# EAGLE design socket-v2-low-voltage (EAGLE 6.2)
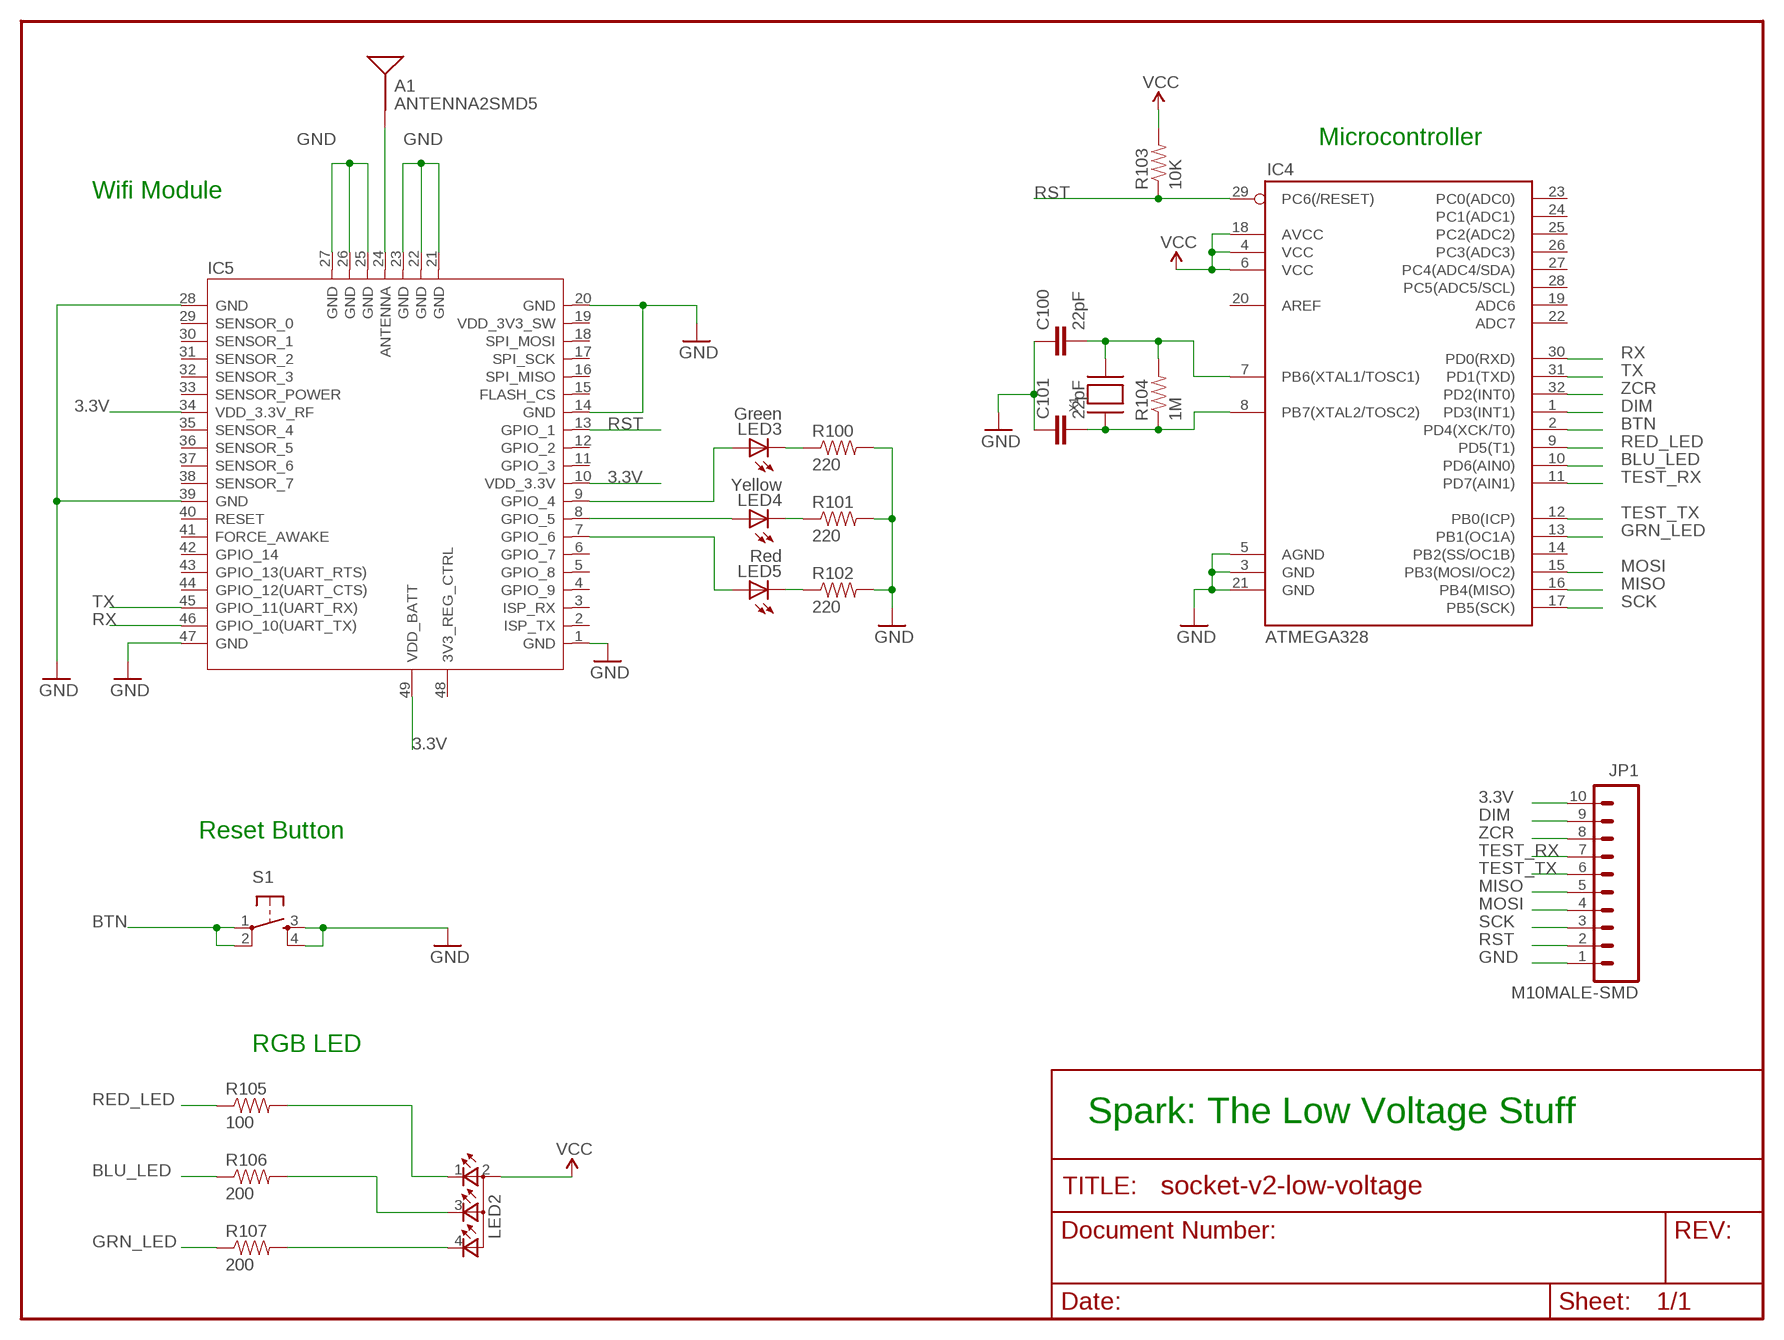
[diagram p0: schematic, sheet 1]

## Parts
A1  ANTENNA2SMD5  [ANTENNA-CHIP5]
C100  22pF  CAP0603-CAP  [0603-CAP]
C101  22pF  CAP0603-CAP  [0603-CAP]
IC4  ATMEGA328  ATMEGA168  [TQFP32-08]
IC5  WIFI-RN-171  [49P-1.27-26.67X17.78]
JP1  M10MALE-SMD  [1X10-2MM-MALE-SMD]
LED2  TOPLED-3PLCC  [P-LCC-4-3]
LED3  Green  LED0603  [LED-0603]
LED4  Yellow  LED0603  [LED-0603]
LED5  Red  LED0603  [LED-0603]
R100  220  RESISTOR0603-RES  [0603-RES]
R101  220  RESISTOR0603-RES  [0603-RES]
R102  220  RESISTOR0603-RES  [0603-RES]
R103  10K  RESISTOR0603-RES  [0603-RES]
R104  1M  RESISTOR0603-RES  [0603-RES]
R105  100  RESISTOR0603-RES  [0603-RES]
R106  200  RESISTOR0603-RES  [0603-RES]
R107  200  RESISTOR0603-RES  [0603-RES]
S1  TAC_SWITCHSMD  [TACTILE_SWITCH_SMD]
X1  XTALNX5032  [NX5032]

## Nets
3.3V: IC4.4(VCC) IC4.6(VCC) IC4.18(AVCC) IC5.10(VDD_3.3V) IC5.34(VDD_3.3V_RF) IC5.49(VDD_BATT) JP1.10 LED2.2(A2) R103.2 ; supply symbol labelled VCC
BLU_LED: IC4.10(PD6(AIN0)) R106.1
BTN: IC4.2(PD4(XCK/T0)) S1.1 S1.2
DIM: IC4.1(PD3(INT1)) JP1.9
GND: C100.1 C101.1 IC4.3(GND) IC4.5(AGND) IC4.21(GND) IC5.1(GND) IC5.14(GND) IC5.20(GND) IC5.21(GND) IC5.22(GND) IC5.23(GND) IC5.25(GND) IC5.26(GND) IC5.27(GND) IC5.28(GND) IC5.39(GND) IC5.47(GND) JP1.1 R100.2 R101.2 R102.2 S1.3 S1.4
GRN_LED: IC4.13(PB1(OC1A)) R107.1
MISO: IC4.16(PB4(MISO)) JP1.5
MOSI: IC4.15(PB3(MOSI/OC2)) JP1.4
N$1: LED2.1(CRED) R105.2
N$8: LED2.4(CGREEN) R107.2
N$15: LED2.3(CBLUE) R106.2
N$19: IC5.9(GPIO_4) LED3.A
N$20: LED3.C R100.1
N$21: LED4.C R101.1
N$22: LED5.C R102.1
N$23: IC5.8(GPIO_5) LED4.A
N$24: IC5.7(GPIO_6) LED5.A
N$25: A1.FEED(SIGNAL) IC5.24(ANTENNA)
N$38: C100.2 IC4.7(PB6(XTAL1/TOSC1)) R104.2 X1.P$2
RED_LED: IC4.9(PD5(T1)) R105.1
RST: IC4.29(PC6(/RESET)) IC5.13(GPIO_1) JP1.2 R103.1
RX: IC4.30(PD0(RXD)) IC5.46(GPIO_10(UART_TX))
SCK: IC4.17(PB5(SCK)) JP1.3
TEST_RX: IC4.11(PD7(AIN1)) JP1.7
TEST_TX: IC4.12(PB0(ICP)) JP1.6
TX: IC4.31(PD1(TXD)) IC5.45(GPIO_11(UART_RX))
XTAL1: C101.2 IC4.8(PB7(XTAL2/TOSC2)) R104.1 X1.P$1
ZCR: IC4.32(PD2(INT0)) JP1.8
Unconnected: IC4.14(PB2(SS/OC1B)) IC4.19(ADC6) IC4.20(AREF) IC4.22(ADC7) IC4.23(PC0(ADC0)) IC4.24(PC1(ADC1)) IC4.25(PC2(ADC2)) IC4.26(PC3(ADC3)) IC4.27(PC4(ADC4/SDA)) IC4.28(PC5(ADC5/SCL)) IC5.2(ISP_TX) IC5.3(ISP_RX) IC5.4(GPIO_9) IC5.5(GPIO_8) IC5.6(GPIO_7) IC5.11(GPIO_3) IC5.12(GPIO_2) IC5.15(FLASH_CS) IC5.16(SPI_MISO) IC5.17(SPI_SCK) IC5.18(SPI_MOSI) IC5.19(VDD_3V3_SW) IC5.29(SENSOR_0) IC5.30(SENSOR_1) IC5.31(SENSOR_2) IC5.32(SENSOR_3) IC5.33(SENSOR_POWER) IC5.35(SENSOR_4) IC5.36(SENSOR_5) IC5.37(SENSOR_6) IC5.38(SENSOR_7) IC5.40(RESET) IC5.41(FORCE_AWAKE) IC5.42(GPIO_14) IC5.43(GPIO_13(UART_RTS)) IC5.44(GPIO_12(UART_CTS)) IC5.48(3V3_REG_CTRL)

## Notes on the sheet
- Microcontroller
- Wifi Module
- Reset Button
- RGB LED
- Spark: The Low Voltage Stuff

## Library data of the parts
A1 = SparkFun:ANTENNA2: Antenna Single endded antenna. Common with smaller chip antennas. CHIP4 package is the GPS Chip Antenna SKU: GPS-08418. CHIP5 package is 2.4GHz chip antenna SKU: WRL-00144.
C100 C101 = SparkFun:CAP: Capacitor Standard 0603 ceramic capacitor, and 0.1" leaded capacitor.
IC4 = SparkFun:ATMEGA168
IC5 = Module:WIFI-RN-171: WIFLY GSX 802.11 b/g wireless LAN Module
JP1 = Spark-3:M10: Header 10 Standard 10-pin 0.1" header. Use with straight break away headers (SKU : PRT-00116), right angle break away headers (PRT-00553), swiss pins (PRT-00743), machine pins (PRT-00117), and female headers (PRT-00115).
LED2 = Spark:TOPLED-3: Cree CLVBA-FKA
LED3-LED5 = SparkFun:LED: LEDs Standard schematic elements and footprints for 5mm, 3mm, 1206, and 0603 sized LEDs. 5mm - Spark Fun Electronics SKU : COM-00529 (and others)
R100-R107 = SparkFun:RESISTOR: Resistor Basic schematic elements and footprints for 0603, 1206, and PTH resistors.
S1 = SparkFun:TAC_SWITCH: Momentary Switch Button commonly used for reset or general input. Spark Fun Electronics SKU : COM-00097
X1 = adafruit:XTAL: Low cost SMT crystals, no capacitors included http://www.ladyada.net/library/eagle

## Net classes
2 gnd: width 0.203 mm, drill 0.559 mm, clearance 0.152 mm
3 usbvcc: width 0.203 mm, drill 0.61 mm, clearance 0.152 mm
4 aref: width 0.203 mm, drill 0.61 mm, clearance 0.152 mm

## Board
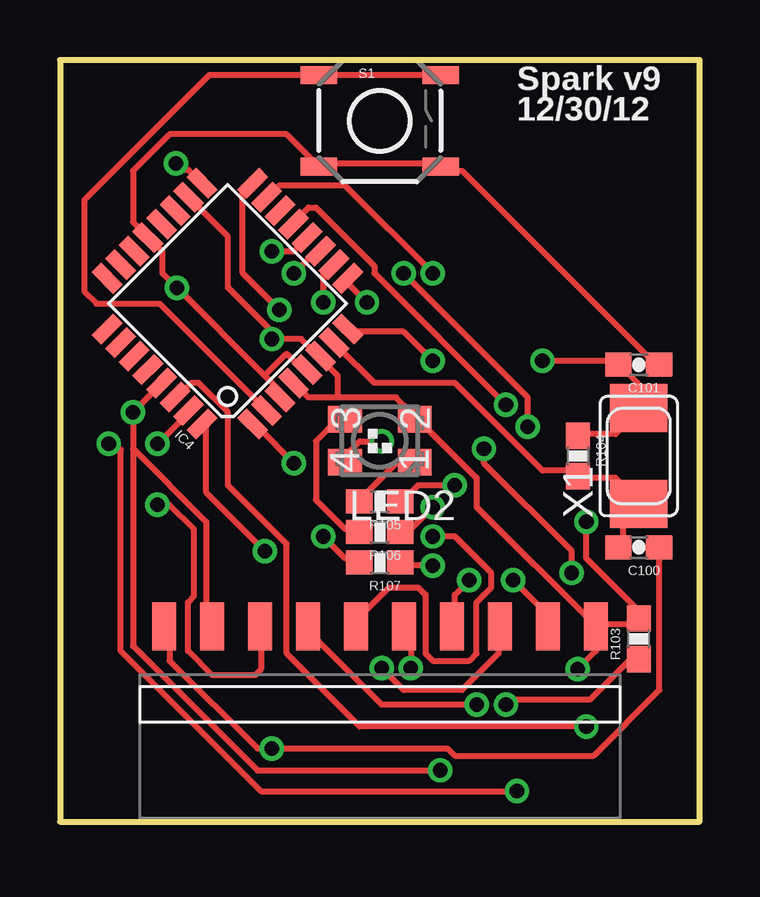
[diagram p1: board, top side]
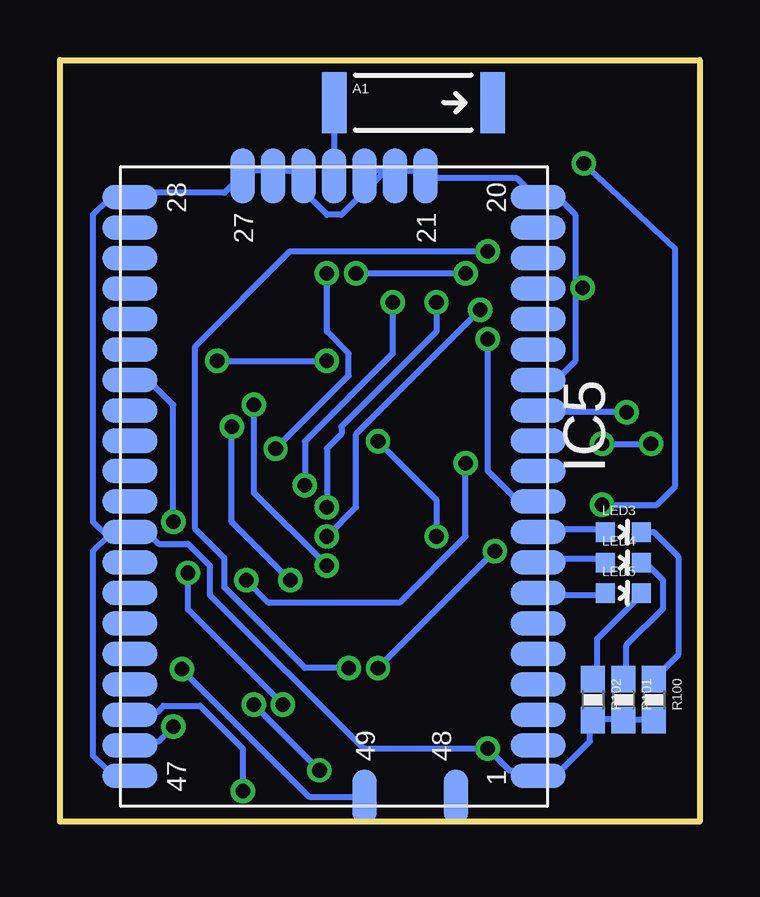
[diagram p2: board, bottom side, seen from below]

Size 26.67 x 31.75 mm. Coordinates in mm from the lower left corner, seen from the top.
Outline: 0,0 26.67,0 26.67,31.75 0,31.75 0,0
Copper layers (1*16): Top 0.035mm / dielectric 1.5mm / Bottom 0.035mm
Design rules: minimum track width 10mil, minimum drill 24mil, track to track 8mil, track to pad 8mil, pad to pad 8mil, via to via 8mil, smd to smd 8mil, copper to edge 40mil, drill to drill 8mil, minimum pad ring 12mil, minimum via ring 8mil, stop-mask expansion 4mil, vias tented up to drill 0mil, thermal gap 10mil

### Footprints (pad centres in the part's own frame; a part is rotated, then mirrored left to right if it is on the bottom)
ANTENNA-CHIP5 = smd 1.016 x 2.54: FEED -3.302,0; NC 3.302,0
0603-CAP = smd 1.1 x 1: 1 -0.85,0; 2 0.85,0
TQFP32-08 = smd 1.27 x 0.559: 1 -4.293,2.8; 2 -4.293,2; 3 -4.293,1.2; 4 -4.293,0.4; 5 -4.293,-0.4; 6 -4.293,-1.2; 7 -4.293,-2; 8 -4.293,-2.8; 17 4.293,-2.8; 18 4.293,-2; 19 4.293,-1.2; 20 4.293,-0.4; 21 4.293,0.4; 22 4.293,1.2; 23 4.293,2; 24 4.293,2.8 | smd 0.559 x 1.27: 9 -2.8,-4.293; 10 -2,-4.293; 11 -1.2,-4.293; 12 -0.4,-4.293; 13 0.4,-4.293; 14 1.2,-4.293; 15 2,-4.293; 16 2.8,-4.293; 25 2.8,4.293; 26 2,4.293; 27 1.2,4.293; 28 0.4,4.293; 29 -0.4,4.293; 30 -1.2,4.293; 31 -2,4.293; 32 -2.8,4.293
49P-1.27-26.67X17.78 = smd 1.016 x 2.286: 1 12.065,8.509; 2 10.795,8.509; 3 9.525,8.509; 4 8.255,8.509; 5 6.985,8.509; 6 5.715,8.509; 7 4.445,8.509; 8 3.175,8.509; 9 1.905,8.509; 10 0.635,8.509; 11 -0.635,8.509; 12 -1.905,8.509; 13 -3.175,8.509; 14 -4.445,8.509; 15 -5.715,8.509; 16 -6.985,8.509; 17 -8.255,8.509; 18 -9.525,8.509; 19 -10.795,8.509; 20 -12.065,8.509; 28 -12.065,-8.509; 29 -10.795,-8.509; 30 -9.525,-8.509; 31 -8.255,-8.509; 32 -6.985,-8.509; 33 -5.715,-8.509; 34 -4.445,-8.509; 35 -3.175,-8.509; 36 -1.905,-8.509; 37 -0.635,-8.509; 38 0.635,-8.509; 39 1.905,-8.509; 40 3.175,-8.509; 41 4.445,-8.509; 42 5.715,-8.509; 43 6.985,-8.509; 44 8.255,-8.509; 45 9.525,-8.509; 46 10.795,-8.509; 47 12.065,-8.509 | smd 2.286 x 1.016: 21 -12.954,3.81; 22 -12.954,2.54; 23 -12.954,1.27; 24 -12.954,0; 25 -12.954,-1.27; 26 -12.954,-2.54; 27 -12.954,-3.81; 48 12.954,5.08; 49 12.954,1.27
1X10-2MM-MALE-SMD = smd 1 x 2: 1 -9,0; 2 -7,0; 3 -5,0; 4 -3,0; 5 -1,0; 6 1,0; 7 3,0; 8 5,0; 9 7,0; 10 9,0
P-LCC-4-3 = smd 1.1 x 1.4: 1 -0.9,-1.45; 2 0.9,-1.45; 3 0.9,1.45; 4 -0.9,1.45
LED-0603 = smd 0.8 x 0.8: A 0,-0.75; C 0,0.75
0603-RES = smd 1.1 x 1: 1 -0.85,0; 2 0.85,0
TACTILE_SWITCH_SMD = smd 1.524 x 0.762: 1 -2.54,1.905; 2 2.54,1.905; 3 -2.54,-1.905; 4 2.54,-1.905
NX5032 = smd 2 x 2.4: P$1 2,0; P$2 -2,0

### Placement (x,y rotation side)
A1  11.94,29.97 0 bottom
C100  24.13,11.43 180 top
C101  24.13,19.05 180 top
IC4  6.99,21.59 135 top
IC5  15.24,13.97 270 bottom
JP1  13.34,8.13 0 top
LED2  13.34,15.88 90 top
LED3  3.17,12.06 270 bottom
LED4  3.17,10.79 270 bottom
LED5  3.17,9.53 270 bottom
R100  1.91,5.08 270 bottom
R101  3.17,5.08 270 bottom
R102  4.45,5.08 270 bottom
R103  24.13,7.62 90 top
R104  21.59,15.24 270 top
R105  13.34,13.34 180 top
R106  13.34,12.06 180 top
R107  13.34,10.79 180 top
S1  13.34,29.21 0 top
X1  24.13,15.24 90 top

### Tracks (layer width: path | path; a pad name or v marks a point on that pad's centre or on a via)
3.3V  (via drill 0.61)
  Top 0.254: JP1.10 22.55,8.23 24.08,8.23 R103.2 24.38,8.53 21.95,10.97 v21.95,12.5 | 11.58,17.68 14.02,17.68 14.63,17.07 LED2.2 14.94,16.76 17.37,14.33 17.37,13.11 22.25,8.23 JP1.10 | 11.58,17.68 10.36,17.68 9.75,18.29 IC4.4 | 8.84,20.42 9.14,20.12 10.06,20.12 10.67,19.51 IC4.6 10.97,19.2 11.58,18.59 11.58,17.68 | 8.84,20.42 7.01,22.25 7.01,24.38 5.49,25.91 IC4.18 | 8.84,20.42 v8.84,20.12 | v21.59,6.35 22.35,7.11 22.35,8.13 JP1.10
  Bottom 0.254: v21.95,12.5 21.95,17.37 22.86,18.29 23.47,18.29 IC5.34 | v8.84,20.12 8.84,14.63 7.62,13.41 7.01,13.41 IC5.10 | IC5.49 16.26,1.02 v21.59,6.35
BLU_LED  (via drill 0.61)
  Top 0.254: v15.54,13.11 14.63,12.19 14.33,12.19 R106.1 | v10.97,21.64 10.97,22.86 11.28,23.16 IC4.10
  Bottom 0.254: v15.54,13.11 15.54,15.54 14.94,16.15 14.94,16.46 10.97,20.42 v10.97,21.64
BTN
  Top 0.254: S1.2 S1.1 6.22,31.11 1.02,25.91 1.02,22.1 1.52,21.59 4.16,21.59 IC4.2
DIM  (via drill 0.61)
  Top 0.254: v9.75,14.94 8.23,16.46 IC4.1 | v18.9,10.06 20.12,8.84 20.12,8.23 JP1.9
  Bottom 0.254: v9.75,14.94 9.75,11.89 12.5,9.14 17.98,9.14 v18.9,10.06
GND  (via drill 0.61)
  Top 0.254: C100.1 24.99,11.28 24.99,5.49 22.25,2.74 16.46,2.74 16.15,3.05 v8.84,3.05 8.23,3.05 4.57,6.71 4.57,7.92 JP1.1 | 8.53,18.59 v4.88,22.25 4.27,22.86 4.27,23.77 3.96,24.08 IC4.21 3.66,24.38 3.05,24.99 3.05,27.13 4.57,28.65 9.45,28.65 S1.3 10.97,27.43 15.85,27.43 S1.4 16.15,27.13 16.76,27.13 24.69,19.2 C101.1 | 8.53,18.59 9.14,17.98 IC4.3 | 8.53,18.59 9.45,19.51 10.06,18.9 IC4.5
  Bottom 0.254: R100.2 2.13,4.27 3.05,4.27 R101.2 3.35,4.27 4.27,4.27 R102.2 4.57,3.96 4.57,3.35 5.79,2.13 6.71,2.13 IC5.1 7.01,2.13 7.92,2.13 v8.84,3.05 14.02,3.05 20.42,9.45 20.42,10.67 21.34,11.58 22.55,11.58 22.86,11.89 23.47,11.89 IC5.39 | 24.69,11.89 25.3,11.28 25.3,2.74 24.69,2.13 23.77,2.13 IC5.47 | 24.69,11.89 23.77,11.89 IC5.39 | IC5.22 12.5,27.13 11.58,27.13 IC5.21 11.28,26.82 7.62,26.82 7.01,26.21 IC5.20 6.71,25.91 5.79,25.91 5.18,25.3 5.18,22.25 | 13.11,27.13 12.8,27.13 IC5.22 | 13.11,27.13 13.72,27.13 IC5.23 | 5.18,22.25 5.18,19.2 5.79,18.59 6.71,18.59 IC5.14 | 13.11,27.13 14.94,25.3 15.54,25.3 16.46,26.21 16.46,26.82 IC5.25 16.76,27.13 17.68,27.13 IC5.26 17.98,27.13 18.9,27.13 IC5.27 19.2,26.82 19.81,26.21 23.47,26.21 IC5.28 23.77,25.91 24.69,25.91 25.3,25.3 25.3,12.5 24.69,11.89 | 13.11,27.13 IC5.22 | 24.69,11.89 IC5.39 | 5.18,22.25 v4.88,22.25
GRN_LED  (via drill 0.61)
  Top 0.254: v15.54,10.67 14.33,10.67 R107.1 | v18.59,17.37 13.11,22.86 13.11,23.16 10.67,25.6 10.36,25.6 9.75,24.99 IC4.13
  Bottom 0.254: v15.54,10.67 18.59,13.72 v18.59,17.37
MISO  (via drill 0.61)
  Top 0.254: v9.14,21.34 7.62,22.86 7.62,26.21 7.92,26.52 IC4.16 | v15.54,11.89 16.46,11.89 17.98,10.36 17.98,9.75 17.37,9.14 17.37,7.01 17.07,6.71 15.54,6.71 15.24,7.01 15.24,9.45 14.94,9.75 13.72,9.75 12.19,8.23 JP1.5
  Bottom 0.254: v9.14,21.34 14.33,16.15 14.33,13.11 v15.54,11.89
MOSI  (via drill 0.61)
  Top 0.254: v15.54,22.86 11.89,26.52 9.14,26.52 8.84,26.21 IC4.15 | v17.68,15.54 17.68,14.94 21.34,11.28 v21.34,10.36 | v17.37,4.88 13.41,4.88 10.36,7.92 JP1.4
  Bottom 0.254: v15.54,22.86 15.54,20.42 14.63,19.51 14.63,18.59 v17.68,15.54 | v21.34,10.36 21.34,8.84 v17.37,4.88
N$1
  Top 0.254: R105.2 12.5,13.41 14.02,14.94 14.63,14.94 LED2.1
N$8  (via drill 0.61)
  Top 0.254: v10.97,11.89 11.89,10.97 12.19,10.97 R107.2 | v13.41,15.85 12.5,15.85 11.89,15.24 LED2.4
  Bottom 0.254: v10.97,11.89 10.97,13.41 v13.41,15.85
N$15
  Top 0.254: R106.2 12.19,12.19 11.89,12.19 10.67,13.41 10.67,15.85 11.58,16.76 LED2.3
N$19
  Bottom 0.254: LED3.A 3.96,12.19 6.71,12.19 IC5.9
N$20
  Bottom 0.254: LED3.C 1.91,12.06 0.89,11.05 0.89,6.95 R100.1
N$21
  Bottom 0.254: LED4.C 2.13,10.67 1.52,10.06 1.52,8.89 3.05,7.37 3.05,6.1 R101.1
N$22
  Bottom 0.254: LED5.C 2.44,9.45 4.27,7.62 4.27,6.1 R102.1
N$23
  Bottom 0.254: LED4.A 3.96,10.97 6.71,10.97 IC5.8
N$24
  Bottom 0.254: LED5.A 3.96,9.45 6.71,9.45 IC5.7
N$25
  Bottom 0.254: A1.FEED IC5.24
N$38
  Top 0.254: 23.47,14.02 24.08,13.41 X1.P$2 23.47,14.02 | 23.47,14.02 23.16,14.33 21.64,14.33 R104.2 21.34,14.63 20.12,14.63 16.46,18.29 13.11,18.29 11.58,19.81 IC4.7 | 23.47,14.02 23.47,11.58 C100.2
RED_LED  (via drill 0.61)
  Top 0.254: v16.46,14.02 14.94,14.02 14.33,13.41 R105.1 | v12.8,21.64 11.89,22.55 IC4.9
  Bottom 0.254: v16.46,14.02 16.46,15.85 12.8,19.51 v12.8,21.64
RST  (via drill 0.61)
  Top 0.254: v15.85,2.13 8.23,2.13 3.05,7.32 3.05,15.54 | 3.05,15.54 v3.05,17.07 3.96,17.98 IC4.29 | R103.1 24.08,6.71 23.72,6.71 22.1,5.08 18.8,5.08 v18.59,4.88 | JP1.2 6.1,8.23 6.1,12.5 3.05,15.54
  Bottom 0.254: v15.85,2.13 v18.59,4.88 | v3.05,17.07 6.71,17.07 IC5.13
RX  (via drill 0.61)
  Top 0.254: v21.95,3.96 12.5,3.96 9.45,7.01 9.45,11.58 7.01,14.02 7.01,17.07 5.79,18.29 5.49,18.29 5.18,17.98 4.88,17.98 IC4.30
  Bottom 0.254: v21.95,3.96 22.55,3.35 23.47,3.35 IC5.46
SCK  (via drill 0.61)
  Top 0.254: v4.83,27.43 5.08,27.18 5.33,27.18 5.84,26.67 IC4.17 | v4.06,13.21 4.57,13.21 5.59,12.19 5.59,9.4 5.33,9.14 5.33,7.11 6.35,6.1 8.13,6.1 8.38,6.35 8.38,8.13 JP1.3
  Bottom 0.254: v4.83,27.43 1.02,23.88 1.02,13.97 1.78,13.21 v4.06,13.21
TEST_RX  (via drill 0.61)
  Top 0.254: v9.75,22.86 10.67,23.77 IC4.11 | v14.33,22.86 19.51,17.68 v19.51,16.46 | v17.07,10.06 16.46,9.45 16.46,8.23 JP1.7
  Bottom 0.254: v14.33,22.86 v9.75,22.86 | v19.51,16.46 19.51,12.5 v17.07,10.06
TEST_TX  (via drill 0.61)
  Top 0.254: v8.84,23.77 9.75,23.77 10.06,24.08 IC4.12 | v14.63,6.4 14.63,7.92 JP1.6
  Bottom 0.254: v8.84,23.77 17.07,23.77 21.03,19.81 21.03,12.19 19.81,10.97 19.81,9.75 16.46,6.4 v14.63,6.4
TX  (via drill 0.61)
  Top 0.254: v19.05,1.27 8.38,1.27 2.54,7.11 2.54,15.49 2.29,15.75 v2.03,15.75 | v4.06,15.75 5.33,17.02 IC4.31
  Bottom 0.254: v19.05,1.27 19.05,3.05 20.83,4.83 22.35,4.83 22.61,4.57 23.62,4.57 IC5.45 | v4.06,15.75 v2.03,15.75
XTAL1  (via drill 0.61)
  Top 0.254: R104.1 21.64,16.15 23.16,16.15 24.08,17.07 X1.P$1 24.13,18.2 24.08,18.29 23.47,18.9 C101.2 23.16,19.2 v20.12,19.2 | v15.54,19.2 14.33,20.42 12.19,20.42 IC4.8
  Bottom 0.254: v20.12,19.2 v15.54,19.2
ZCR  (via drill 0.61)
  Top 0.254: v8.53,11.28 6.1,13.72 6.1,16.46 IC4.32 | v13.41,6.4 14.33,5.49 16.76,5.49 18.29,7.01 18.29,7.92 JP1.8
  Bottom 0.254: v13.41,6.4 v8.53,11.28

### Text on the board
tPlace: Spark v9 | 12/30/12